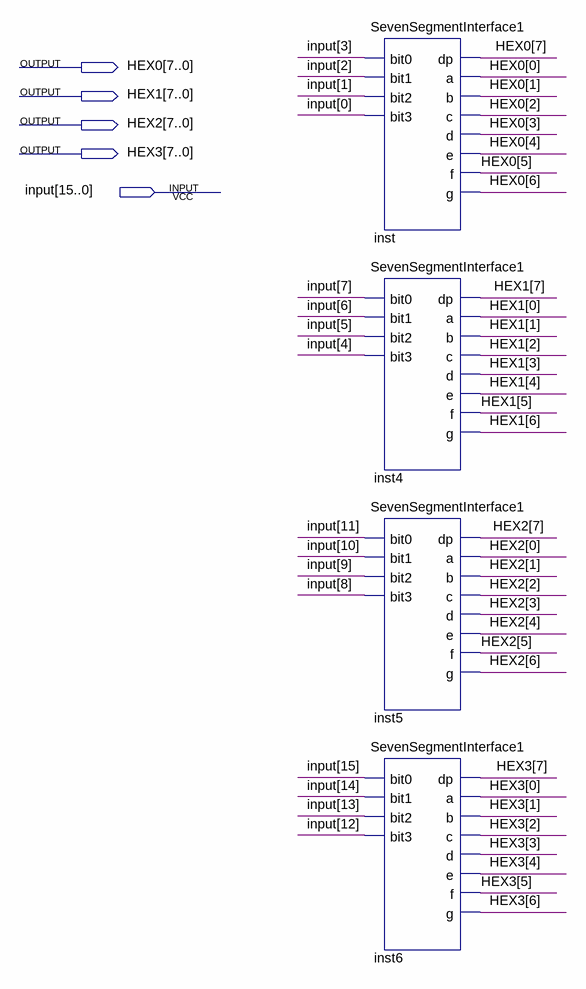
[diagram p0: schematic sheet]
// Quartus schematic SevenSegmentInterface4.bdf as structural Verilog: 4 symbols, 5 pins
module SevenSegmentInterface4 (
  input  [15:0] \input ,
  output [7:0] HEX0,
  output [7:0] HEX1,
  output [7:0] HEX2,
  output [7:0] HEX3
);

  SevenSegmentInterface1 inst (
    .bit0(\input [3]), .bit1(\input [2]), .bit2(\input [1]), .bit3(\input [0]), .dp(HEX0[7]), .a(HEX0[0]),
    .b(HEX0[1]), .c(HEX0[2]), .d(HEX0[3]), .e(HEX0[4]), .f(HEX0[5]), .g(HEX0[6]));
  SevenSegmentInterface1 inst4 (
    .bit0(\input [7]), .bit1(\input [6]), .bit2(\input [5]), .bit3(\input [4]), .dp(HEX1[7]), .a(HEX1[0]),
    .b(HEX1[1]), .c(HEX1[2]), .d(HEX1[3]), .e(HEX1[4]), .f(HEX1[5]), .g(HEX1[6]));
  SevenSegmentInterface1 inst5 (
    .bit0(\input [11]), .bit1(\input [10]), .bit2(\input [9]), .bit3(\input [8]), .dp(HEX2[7]), .a(HEX2[0]),
    .b(HEX2[1]), .c(HEX2[2]), .d(HEX2[3]), .e(HEX2[4]), .f(HEX2[5]), .g(HEX2[6]));
  SevenSegmentInterface1 inst6 (
    .bit0(\input [15]), .bit1(\input [14]), .bit2(\input [13]), .bit3(\input [12]), .dp(HEX3[7]),
    .a(HEX3[0]), .b(HEX3[1]), .c(HEX3[2]), .d(HEX3[3]), .e(HEX3[4]), .f(HEX3[5]), .g(HEX3[6]));
endmodule
